# Altium schematic sheet Switching_circuit.SchDoc
size A4; SheetNumber: 1; SheetTotal: 2
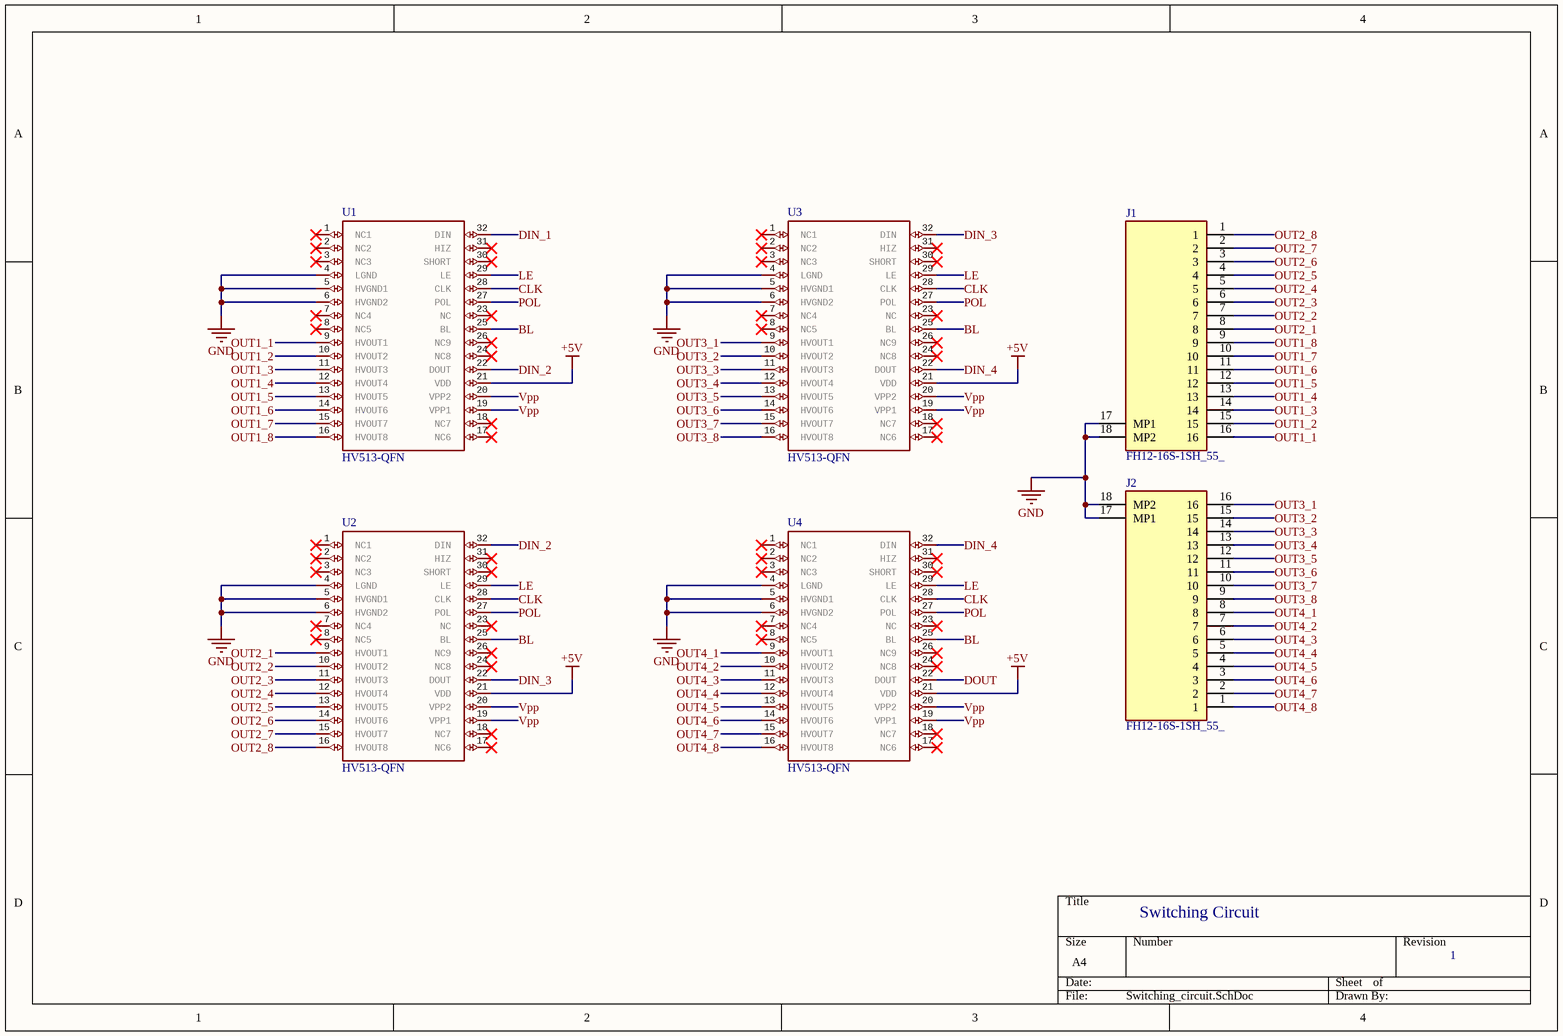
[diagram p0: Switching_circuit.SchDoc]

## Parts
J1  FH12-16S-1SH_55_  [FH1216S1SH55]
J2  FH12-16S-1SH_55_  [FH1216S1SH55]
U1  HV513-QFN  [HV513-QFN]
U2  HV513-QFN  [HV513-QFN]
U3  HV513-QFN  [HV513-QFN]
U4  HV513-QFN  [HV513-QFN]

## Nets
+5V: U1.21(VDD) U2.21(VDD) U3.21(VDD) U4.21(VDD)
GND: J1.17(MP1) J1.18(MP2) J2.17(MP1) J2.18(MP2) U1.4(LGND) U1.5(HVGND1) U1.6(HVGND2) U2.4(LGND) U2.5(HVGND1) U2.6(HVGND2) U3.4(LGND) U3.5(HVGND1) U3.6(HVGND2) U4.4(LGND) U4.5(HVGND1) U4.6(HVGND2)
BL: U1.25(BL) U2.25(BL) U3.25(BL) U4.25(BL)
CLK: U1.28(CLK) U2.28(CLK) U3.28(CLK) U4.28(CLK)
DIN_1: U1.32(DIN)
DIN_2: U1.22(DOUT) U2.32(DIN)
DIN_3: U2.22(DOUT) U3.32(DIN)
DIN_4: U3.22(DOUT) U4.32(DIN)
DOUT: U4.22(DOUT)
LE: U1.29(LE) U2.29(LE) U3.29(LE) U4.29(LE)
OUT1_1: J1.16 U1.9(HVOUT1)
OUT1_2: J1.15 U1.10(HVOUT2)
OUT1_3: J1.14 U1.11(HVOUT3)
OUT1_4: J1.13 U1.12(HVOUT4)
OUT1_5: J1.12 U1.13(HVOUT5)
OUT1_6: J1.11 U1.14(HVOUT6)
OUT1_7: J1.10 U1.15(HVOUT7)
OUT1_8: J1.9 U1.16(HVOUT8)
OUT2_1: J1.8 U2.9(HVOUT1)
OUT2_2: J1.7 U2.10(HVOUT2)
OUT2_3: J1.6 U2.11(HVOUT3)
OUT2_4: J1.5 U2.12(HVOUT4)
OUT2_5: J1.4 U2.13(HVOUT5)
OUT2_6: J1.3 U2.14(HVOUT6)
OUT2_7: J1.2 U2.15(HVOUT7)
OUT2_8: J1.1 U2.16(HVOUT8)
OUT3_1: J2.16 U3.9(HVOUT1)
OUT3_2: J2.15 U3.10(HVOUT2)
OUT3_3: J2.14 U3.11(HVOUT3)
OUT3_4: J2.13 U3.12(HVOUT4)
OUT3_5: J2.12 U3.13(HVOUT5)
OUT3_6: J2.11 U3.14(HVOUT6)
OUT3_7: J2.10 U3.15(HVOUT7)
OUT3_8: J2.9 U3.16(HVOUT8)
OUT4_1: J2.8 U4.9(HVOUT1)
OUT4_2: J2.7 U4.10(HVOUT2)
OUT4_3: J2.6 U4.11(HVOUT3)
OUT4_4: J2.5 U4.12(HVOUT4)
OUT4_5: J2.4 U4.13(HVOUT5)
OUT4_6: J2.3 U4.14(HVOUT6)
OUT4_7: J2.2 U4.15(HVOUT7)
OUT4_8: J2.1 U4.16(HVOUT8)
POL: U1.27(POL) U2.27(POL) U3.27(POL) U4.27(POL)
Vpp: U1.19(VPP1) U1.20(VPP2) U2.19(VPP1) U2.20(VPP2) U3.19(VPP1) U3.20(VPP2) U4.19(VPP1) U4.20(VPP2)

Not connected (* = marked no-connect by the designer): U1 1(NC1)* 2(NC2)* 3(NC3)* 7(NC4)* 8(NC5)* 17(NC6)* 18(NC7)* 23(NC)* 24(NC8)* 26(NC9)* 30(SHORT)* 31(HIZ)*; U2 1(NC1)* 2(NC2)* 3(NC3)* 7(NC4)* 8(NC5)* 17(NC6)* 18(NC7)* 23(NC)* 24(NC8)* 26(NC9)* 30(SHORT)* 31(HIZ)*; U3 1(NC1)* 2(NC2)* 3(NC3)* 7(NC4)* 8(NC5)* 17(NC6)* 18(NC7)* 23(NC)* 24(NC8)* 26(NC9)* 30(SHORT)* 31(HIZ)*; U4 1(NC1)* 2(NC2)* 3(NC3)* 7(NC4)* 8(NC5)* 17(NC6)* 18(NC7)* 23(NC)* 24(NC8)* 26(NC9)* 30(SHORT)* 31(HIZ)*

## Notes on the sheet
- Switching Circuit
- 1

## Library data of the parts
J1 J2 = FH12-16S-1SH_55_: Connector; Manufacturer_Name: Hirose; Manufacturer_Part_Number: FH12-16S-1SH(55); Datasheet Link: https://www.hirose.com/en/product/document?clcode=CL0586-0536-8-55&productname=FH12-16S-1SH(55)&series=FH12&documenttype=2DDrawing&lang=en&documentid=0000987749; Height: 2.2mm; Mouser Part Number: 798-FH12-16S-1SH55; Mouser Price/Stock: https://www.mouser.co.uk/ProductDetail/Hirose-Connector/FH12-16S-1SH55?qs=Ux3WWAnHpjBc3pYMMfcXYg%3D%3D; Arrow Part Number: FH12-16S-1SH(55); Arrow Price/Stock: https://www.arrow.com/en/products/fh12-16s-1sh-55/hirose-electric